# Altium schematic sheet 15V_PowerSupply.SchDoc
size A4; CompanyName: Technische Hochschule Nürnberg Georg Simon Ohm; Address1: Fürther Straße 250; Address2: 90429 Nürnberg; Address3: GERMANY; DocumentNumber: 16; SheetNumber: 16; SheetTotal: 16; CompanyName2: Institut ELSYS
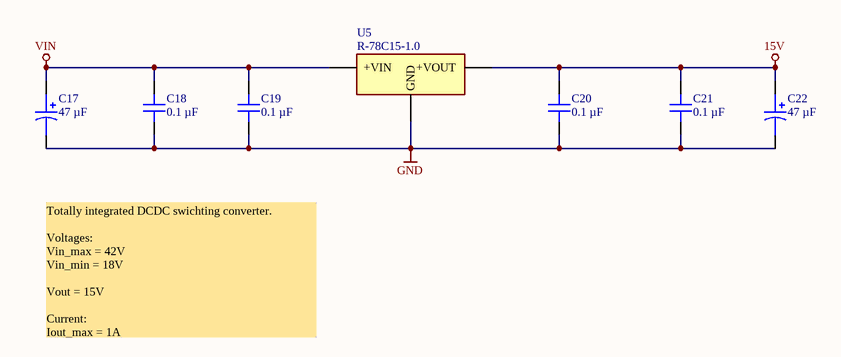
[diagram p0: 15V_PowerSupply.SchDoc]

## Parts
C17  47 µF  [CAPAE830X650N]
C18  0.1 µF  [C_0603]
C19  0.1 µF  [C_0603]
C20  0.1 µF  [C_0603]
C21  0.1 µF  [C_0603]
C22  47 µF  [CAPAE830X650N]
U5  R-78C15-1.0  [R78C1510]

## Nets
15V: C20.2 C21.2 C22.1 U5.3(+VOUT)
GND: C17.2 C18.1 C19.1 C20.1 C21.1 C22.2 U5.2(GND)
VIN: C17.1 C18.2 C19.2 U5.1(+VIN)

## Notes on the sheet
- Totally integrated DCDC swichting converter.
  Voltages:
  Vin_max = 42V
  Vin_min = 18V
  Vout = 15V
  Current:
  Iout_max = 1A
- Title
- Size:
- Date:
- A4
- Revision:
- Time:
- Sheet
- of
- Author:
- Project:

## Library data of the parts
C17 C22 = EEE-1VA470P: Capacitor, 47µF, 35VDC Al Electrolyt; Manufacturer: Panasonic; Tolerance: 20 %; Created from: T. Wendt; Manufacturer Part Number: EEE-1VA470P; PartID: 63; Created On: 26.02.2021 15:32:07; ComponentLink1Description: Datasheet; ComponentLink1URL: https://industrial.panasonic.com/cdbs/www-data/pdf/RDE0000/ABA0000C1145.pdf; Component Type: Capacitor Al Electrolyt; Last Updated: 04.03.2021 09:24:01; Mounting Type: SMD; Operating Temperature: -40 - 85°C; Series: S Series; Supplier 1: Mouser; Supplier Part Number 1: 667-EEE-1VA470P; Type: Capacitor; Voltage Rating: 35 VDC; Value: 47 µF; Live Cycle Status: 1; Stock number: not stored; LCSC Part Number: C336247; Supplier 2: LCSC; Supplier Part Number 2: C336247
C18-C21 = C0603X104K5RAC7411: Capacitor 0603, 50 VDC, 0.1 µF, X7R; Manufacturer: KEMET; Tolerance: 10 %; Voltage Rating: 50 VDC; Created from: MGremer; Manufacturer Part Number: C0603X104K5RAC7411; PartID: 3; Created On: 20.12.2020 13:54:13; ComponentLink1Description: Datasheet; ComponentLink1URL: https://www.mouser.de/datasheet/2/212/1/KEM_C1013_X7R_FT_CAP_SMD-1103280.pdf; Component Type: Capacitor 0603; Device Package: 0603; Last Updated: 04.03.2021 09:24:28; Mounting Type: SMD; Operating Temperature: -55 - 125°C; Series: SMD Comm X7R Flex; Supplier 1: Mouser; Supplier Part Number 1: 80-C0603X104K5R7411; Type: Capacitor; Value: 0.1 µF; Live Cycle Status: 1; Stock number: Labor SMD Container; LCSC Part Number: C14663; Supplier 2: LCSC; Supplier Part Number 2: C14663
U5 = R-78C15-1.0: Not isolated DCDC Converter 15 V Output, 1 A, 18 - 42 V Input; Manufacturer: RECOM; Value: 15V@1A; Created from: T. Wendt; Manufacturer Part Number: R-78C15-1.0; PartID: 12; Created On: 26.02.2021 15:53:07; ComponentLink1Description: Datasheet; ComponentLink1URL: https://recom-power.com/pdf/Innoline/R-78C-1.0.pdf; Component Type: Not isolated DCDC Converter; Device Package: SIP-3; Last Updated: 26.02.2021 15:53:07; Mounting Type: THT; Operating Temperature: -40 - 85 °C; Series: R-78C-1.0; Supplier 1: Mouser; Supplier Part Number 1: 919-R-78C15-1.0; Type: not isolated DCDC converter; Live Cycle Status: 1; Stock number: not stored